# Altium schematic sheet Power.SchDoc
size Letter
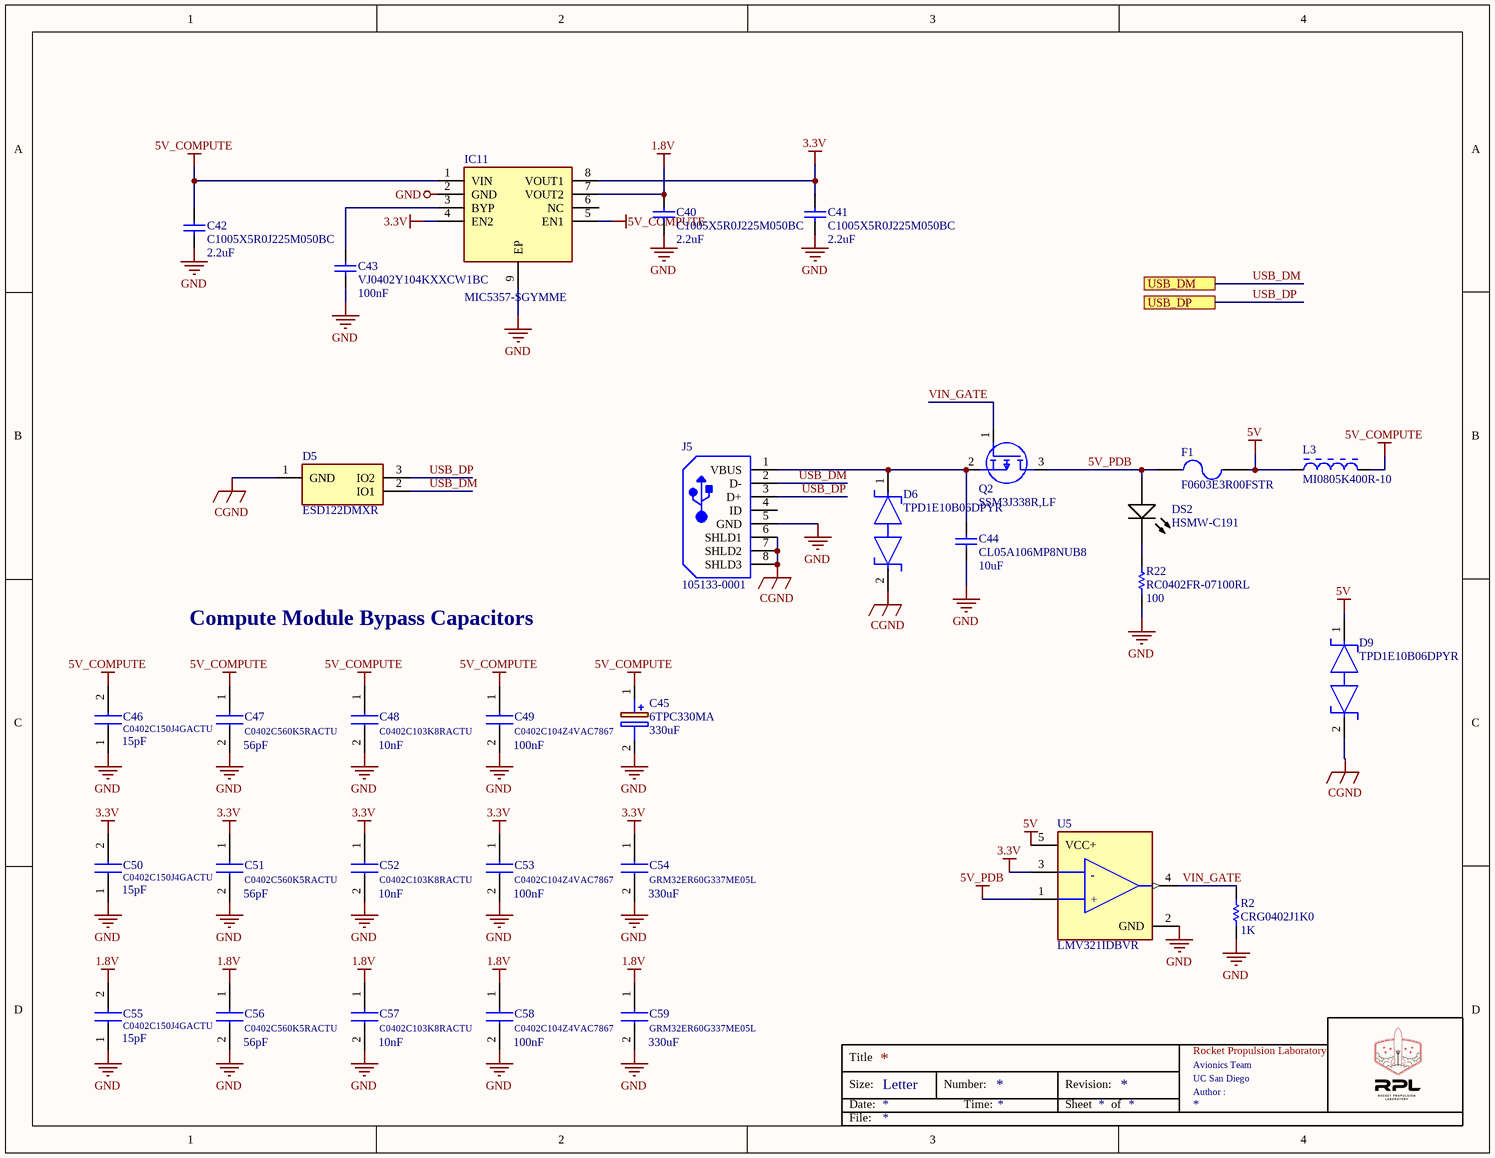
[diagram p0: Power.SchDoc]

## Parts
C40  C1005X5R0J225M050BC  value 2.2uF  [0402]
C41  C1005X5R0J225M050BC  value 2.2uF  [0402]
C42  C1005X5R0J225M050BC  value 2.2uF  [0402]
C43  VJ0402Y104KXXCW1BC  value 100nF  [0402]
C44  CL05A106MP8NUB8  value 10uF  [0402]
C45  6TPC330MA  value 330uF  [CAPPM7343X200N]
C46  C0402C150J4GACTU  value 15pF  [CAPC1005X90N]
C47  C0402C560K5RACTU  value 56pF  [CAPC1005X55N]
C48  C0402C103K8RACTU  value 10nF  [CAPC1005X55N]
C49  C0402C104Z4VAC7867  value 100nF  [CAPC1005X55N]
C50  C0402C150J4GACTU  value 15pF  [CAPC1005X90N]
C51  C0402C560K5RACTU  value 56pF  [CAPC1005X55N]
C52  C0402C103K8RACTU  value 10nF  [CAPC1005X55N]
C53  C0402C104Z4VAC7867  value 100nF  [CAPC1005X55N]
C54  GRM32ER60G337ME05L  value 330uF  [CAPC3225X280N]
C55  C0402C150J4GACTU  value 15pF  [CAPC1005X90N]
C56  C0402C560K5RACTU  value 56pF  [CAPC1005X55N]
C57  C0402C103K8RACTU  value 10nF  [CAPC1005X55N]
C58  C0402C104Z4VAC7867  value 100nF  [CAPC1005X55N]
C59  GRM32ER60G337ME05L  value 330uF  [CAPC3225X280N]
D5  ESD122DMXR  [DMX0003A]
D6  TPD1E10B06DPYR  [FP-DPY0002A-MFG]
D9  TPD1E10B06DPYR  [FP-DPY0002A-MFG]
DS2  HSMW-C191  [AVAG-HSMW-C191_V]
F1  F0603E3R00FSTR  [1608[0603]]
IC11  MIC5357-SGYMME  [SOP65P490X104-9N]
J5  105133-0001  [MOLX-105133-0001_V]
L3  MI0805K400R-10  [LIRD-MI0805K400R-10_V]
Q2  SSM3J338R,LF  [SSM3J332RLFT]
R2  CRG0402J1K0  value 1K  [0402]
R22  RC0402FR-07100RL  spec: 100  [RESC1005X40X25ML05T10]
U5  LMV321IDBVR  [FP-DBV0005A-MFG]

## Ports
USB_DM, USB_DP

## Nets
1.8V: C40.2 C55.2 C56.1 C57.1 C58.1 C59.1 IC11.7(VOUT2)
3.3V: C41.2 C50.2 C51.1 C52.1 C53.1 C54.1 IC11.4(EN2) IC11.8(VOUT1) U5.3(1IN-)
5V: D9.1 F1.2 L3.1 U5.5(VCC+)
5V_COMPUTE: C42.2 C45.1(+) C46.2 C47.1 C48.1 C49.1 IC11.1(VIN) IC11.5(EN1) L3.2
5V_PDB: DS2.1(A) F1.1 Q2.3(D) U5.1(1IN+)
CGND: D5.1(GND) D6.2 D9.2 J5.6(SHLD1) J5.7(SHLD2) J5.8(SHLD3)
GND: C40.1 C41.1 C42.1 C43.1 C44.1 C45.2(-) C46.1 C47.2 C48.2 C49.2 C50.1 C51.2 C52.2 C53.2 C54.2 C55.1 C56.2 C57.2 C58.2 C59.2 IC11.2(GND) IC11.9(EP) J5.5(GND) R2.2 R22.1 U5.2(GND)
USB_DM: D5.2(IO1) J5.2(D-) ; port USB_DM
USB_DP: D5.3(IO2) J5.3(D+) ; port USB_DP
VIN_GATE: Q2.1(G) R2.1 U5.4(OUT)
NetC43_2: C43.2 IC11.3(BYP)
NetC44_2: C44.2 D6.1 J5.1(VBUS) Q2.2(S)
NetDS2_2: DS2.2(K) R22.2

Not connected (* = marked no-connect by the designer): IC11 6(NC); J5 4(ID)

## Notes on the sheet
- Compute Module Bypass Capacitors
- Title
- Size:
- Date:
- Letter
- Number:
- Time:
- Revision:
- Sheet
- of
- Rocket Propulsion Laboratory
- UC San Diego
- Avionics Team
- Author :
- File:
- (in symbol CMP-04895-000056-1) -; +

## Library data of the parts
C40-C44 = Cap: Capacitor; Published: 8-Jun-2000; LatestRevisionDate: 17-Jul-2002; LatestRevisionNote: Re-released for DXP Platform.; PackageReference: RAD-0.3; Publisher: Altium Limited; PackageDescription: Radial Cap, Thru-Hole; 2 Leads; 0.3 in Pin Spacing
C45 = 6TPC330MA: Capacitor Polarised; Manufacturer_Name: Panasonic; Datasheet Link: https://industrial.panasonic.com/cdbs/www-data/pdf/AAA8000/AAA8000C68.pdf; Height: 2mm; Manufacturer_Part_Number: 6TPC330MA; Arrow Part Number: 6TPC330MA; Arrow Price/Stock: https://www.arrow.com/en/products/6tpc330ma/panasonic; Mouser Part Number: 667-6TPC330MA; Mouser Price/Stock: https://www.mouser.co.uk/ProductDetail/Panasonic/6TPC330MA?qs=OE1iw1LrrPEq6z1np%252BZymw%3D%3D
C46 C50 C55 = C0402C150J4GACTU: Capacitor; Manufacturer_Name: Kemet; Datasheet Link: https://content.kemet.com/datasheets/KEM_C1002_X7R_SMD.pdf; Height: 0.55mm; Manufacturer_Part_Number: C0402C150J4GACTU; Arrow Part Number: C0402C150J4GACTU; Arrow Price/Stock: https://www.arrow.com/en/products/c0402c150j4gactu/kemet-corporation; Mouser Part Number: 80-C0402C150J4G; Mouser Price/Stock: https://www.mouser.com/Search/Refine.aspx?Keyword=80-C0402C150J4G
C47 C49 C51 C53 C56 C58 = C0402C560K5RACTU: Capacitor; Manufacturer_Name: Kemet; Datasheet Link: https://content.kemet.com/datasheets/KEM_C1002_X7R_SMD.pdf; Height: 0.55mm; Manufacturer_Part_Number: C0402C560K5RACTU; Arrow Part Number: C0402C560K5RACTU; Mouser Part Number: 80-C0402C560K5RACTU; Mouser Price/Stock: https://www.mouser.co.uk/ProductDetail/KEMET/C0402C560K5RACTU?qs=gt1LBUVyoHmQZW5v3ySgNQ%3D%3D
C48 C52 C57 = C0402C103K8RACTU: Capacitor; Manufacturer_Name: Kemet; Datasheet Link: https://content.kemet.com/datasheets/KEM_C1002_X7R_SMD.pdf; Height: 0.55mm; Manufacturer_Part_Number: C0402C103K8RACTU; Arrow Part Number: C0402C103K8RACTU; Arrow Price/Stock: https://www.arrow.com/en/products/c0402c103k8ractu/kemet-corporation; Mouser Part Number: 80-C0402C103K8R; Mouser Price/Stock: https://www.mouser.co.uk/ProductDetail/KEMET/C0402C103K8RACTU?qs=JAINH4q0Y0HkMNTUebnT7w%3D%3D
C54 C59 = GRM32ER60G337ME05L: Capacitor; Manufacturer_Name: Murata Electronics; Datasheet Link: https://componentsearchengine.com/Datasheets/2/GRM32ER60G337ME05L.pdf; Height: 2.8mm; Manufacturer_Part_Number: GRM32ER60G337ME05L; Arrow Part Number: GRM32ER60G337ME05L; Arrow Price/Stock: https://www.arrow.com/en/products/grm32er60g337me05l/murata-manufacturing; Mouser Part Number: 81-GRM32ER60G337ME5L; Mouser Price/Stock: https://www.mouser.co.uk/ProductDetail/Murata-Electronics/GRM32ER60G337ME05L?qs=MzgNgRTiRUU9wX46aOSi8Q%3D%3D
D5 = ESD122DMXR: TVS Diode (Bi-directional); Manufacturer_Name: Texas Instruments; Datasheet Link: http://www.ti.com/lit/gpn/esd122; Manufacturer_Part_Number: ESD122DMXR; Arrow Part Number: ESD122DMXR; Arrow Price/Stock: https://www.arrow.com/en/products/esd122dmxr/texas-instruments; Mouser Part Number: 595-ESD122DMXR; Mouser Price/Stock: https://www.mouser.co.uk/ProductDetail/Texas-Instruments/ESD122DMXR?qs=gt1LBUVyoHlO%2FS8I%252Bb9aFA%3D%3D
D6 D9 = CMP-04985-000006-1: TVS DIODE 5.5V 14V 2X1SON; Leakage Current: 100nA; Min Breakdown Voltage: 6V; Number of Channels: 1; ESD Protection: Yes; Power Line Protection: No; Test Current: 1mA; Interface: GPIO; Element Configuration: Single; Peak Pulse Current: 5A; Direction: Bidirectional; Peak Pulse Power: 90W; Capacitance: 12pF; Composition: Zener; Packaging: Tape and Reel; Number of Pins: 2; Breakdown Voltage: 6V; Radiation Hardening: No; Min Operating Temperature: -40°C; Contact Plating: Gold; Lead Free: Lead Free; Height: 0.35mm; REACH SVHC: No SVHC; Case/Package: 0402; Max Operating Temperature: 125°C; Width: 0.7mm; Clamping Voltage: 14V; Package Quantity: 1; Max Reverse Leakage Current: 100nA; Working Voltage: 5.5V; Length: 1.1mm; Number of Bidirectional Channels: 1; Reverse Standoff Voltage: 5.5V
DS2 = CMP-1744-00001-1: LED Uni-Color White, 78 mW, 20 mA, -40 to 85 degC, 2-Pin SMD, RoHS, Tape and Reel; Current Rating: 300 mA; Contact Plating: Silver; Width: 12 mm; Package Quantity: 560; ComponentLink2URL: http://docs.avagotech.com/docs/AV02-0186EN; ComponentLink1URL: http://www.avagotech.com/; RoHSCompliant: true; PackageDescription: 2-Pin Surface Mount Device, Body 1.6 x 0.8 mm; Contact Material: Copper; ComponentLink1Description: Manufacturer URL; Mount: Through Hole; Packaging: Bulk; DatasheetVersion: May-10; Height: 12 mm; ComponentLink2Description: Datasheet; Contact Finish: Silver; Max Operating Temperature: 85 degC; Radiation Hardening: No; PackageReference: HSMW-C191; REACH SVHC: Unknown; Min Operating Temperature: -20 degC; Length: 16 mm
F1 = Fuse 2: Fuse; Published: 8-Jun-2000; LatestRevisionDate: 17-Jul-2002; LatestRevisionNote: Re-released for DXP Platform.; PackageReference: PIN-W2/E2.8; Publisher: Altium Limited; PackageDescription: Thru-Hole; 2 Leads
IC11 = MIC5357-SGYMME: Integrated Circuit; Manufacturer_Name: Microchip; Datasheet Link: http://ww1.microchip.com/downloads/en/DeviceDoc/mic5357.pdf; Height: 1.04mm; Manufacturer_Part_Number: MIC5357-SGYMME; Arrow Part Number: MIC5357-SGYMME; Arrow Price/Stock: https://www.arrow.com/en/products/mic5357-sgymme/microchip-technology; Mouser Part Number: 998-MIC5357-SGYMME; Mouser Price/Stock: https://www.mouser.com/Search/Refine.aspx?Keyword=998-MIC5357-SGYMME
J5 = CMP-2000-05829-1: Micro-USB B Receptacle, Vertical, -30 to 85 degC, 5-Pin SMD, RoHS, Tape and Reel; Manufacturer: Molex; Package Version: Rev. C, 11/2015; Voltage Rating: 30VAC; Connector Type: MicroUSBTypeBReceptacle; Current Rating: 1.8A; Number of Ports: 1; Voltage - Max: 30V; Mounting Style: SMD/SMT; Packaging: Reel; Product: MicroUSBTypeBConnectors; Contact Plating: Gold; Flammability Rating: UL94V-0; Package Description: 5-Pin Surface Mount Device, Pitch 0.65 mm; Package Reference: 105133-0001; Contact Material: CopperAlloy; Mounting Angle: Vertical; RoHS: Details; Manufacturer URL: http://www.molex.com/; Factory Pack Quantity: 6000; PartNumber: 105133-0001; Standard: USB; Brand: Molex; Series: 105133; Product Category: USBConnectors; Termination Style: SolderTail; Gender: Receptacle; Package URL: http://www.molex.com/pdm_docs/sd/1051330001_sd.pdf; Datasheet Version: 03/2016; Color: Black; Datasheet URL: http://www.molex.com/webdocs/datasheets/pdf/en-us/1051330001_IO_CONNECTORS.pdf; Mounting Technology: SurfaceMount
L3 = CMP-2000-06702-1: Chip Ferrite Bead, 1.5 A, -40 to 125 degC, 2-Pin SMD (0805), RoHS, Tape and Reel; Manufacturer: Laird; Current Rating (Max): 1.5A; Online Catalog: MISeries; Impedance @ Frequency: 40Ohm@100MHz; Catalog Drawings: (HI,HZ,LI,MI)0805Series_1.10mmMax.Height; Other Names: 240-2389-1; Number of Lines: 1; Filter Type: PowerLine; Kits: 240-2227-ND-KITEMIFERRITEBEADCHIPSMD; DC Resistance (DCR) (Max): 50mOhm; Manufacturer URL: https://www.lairdtech.com/; Ratings: -; Mounting Type: SurfaceMount; Family: FerriteBeadsandChips; Package Description: 2-Pin Surface Mount Device, Body 2 x 1.25 mm; Datasheet URL: http://download.siliconexpert.com/pdfs2/2015/9/8/2/39/55/778/laird_/auto/f.pdf; Category: Filters; Standard Package: 1; Series: MI; Operating Temperature: -40°C~125°C; Package Reference: MI0805K400R-10; Mounting Technology: SurfaceMount; Packaging: CutTape(CT); Size / Dimension: 0.079"Lx0.049"W(2.00mmx1.25mm); Height (Max): 0.043"(1.10mm); Package / Case: 0805(2012Metric); Datasheet Version: Rev. D, 08/2013
Q2 = SSM3J338R,LF: MOSFET (P-Channel); Manufacturer_Name: Toshiba; Datasheet Link: http://toshiba.semicon-storage.com/info/docget.jsp?did=30384&prodName=SSM3J338R; Manufacturer_Part_Number: SSM3J338R,LF; Arrow Part Number: SSM3J338R,LF; Arrow Price/Stock: https://www.arrow.com/en/products/ssm3j338rlf/toshiba; Mouser Part Number: 757-SSM3J338RLF; Mouser Price/Stock: https://www.mouser.co.uk/ProductDetail/Toshiba/SSM3J338RLF?qs=lhkzy8lC%252BSvURFM9ZjmJSw%3D%3D
R2 = Res1: Resistor; Published: 8-Jun-2000; LatestRevisionDate: 17-Jul-2002; LatestRevisionNote: Re-released for DXP Platform.; PackageReference: AXIAL-0.3; Publisher: Altium Limited; PackageDescription: Axial Device, Thru-Hole; 2 Leads; 0.3 in Pin Spacing
R22 = CMP-2002-07344-1: Manufacturer: Yageo / Phycomp; Part Number: RC0402FR-07100RL
U5 = CMP-04895-000056-1: IC OPAMP GP 1 CIRCUIT SOT23-5; Manufacturer: Texas Instruments; Bandwidth: 1MHz; Number Of Channels: 1; Max Junction Temp: +150°C; Input Offset Voltage: 1.7mV; Standoff Height: 0mm; Voltage Gain: 100V/mV; Min Supply Voltage: 2.7V; Input Bias Current: 0.015uA; Nominal Supply Current: 80-130uA; Max Supply Voltage: 5.5V; Ambient Temperature Range Low: -40°C; Device Class L3: Amplifiers - Op Amps; Package: DBV0005A; Temperature: -40°C to +125°C; Automotive: No; Ambient Temperature Range High: +125°C; ComponentLink2Description: Datasheet; Manufacturer Part Number: LMV321IDBVR; Octopart: https://octopart.com/lmv321idbvr-texas+instruments-410381; ComponentLink2URL: http://www.ti.com/lit/ds/symlink/lmv321.pdf; Temperature Range High: +125°C; Device Class L1: Integrated Circuits (ICs); Temperature Range Low: -40°C; Digikey Description: IC OPAMP GP 1 CIRCUIT SOT23-5; RoHS: TRUE; Height: 1.45mm; Mouser Description: Operational Amplifiers - Op Amps Low V R/R; Device Class L2: Linear ICs; Gain Bandwidth: 1MHz; Lead Free: Yes; Category: IC